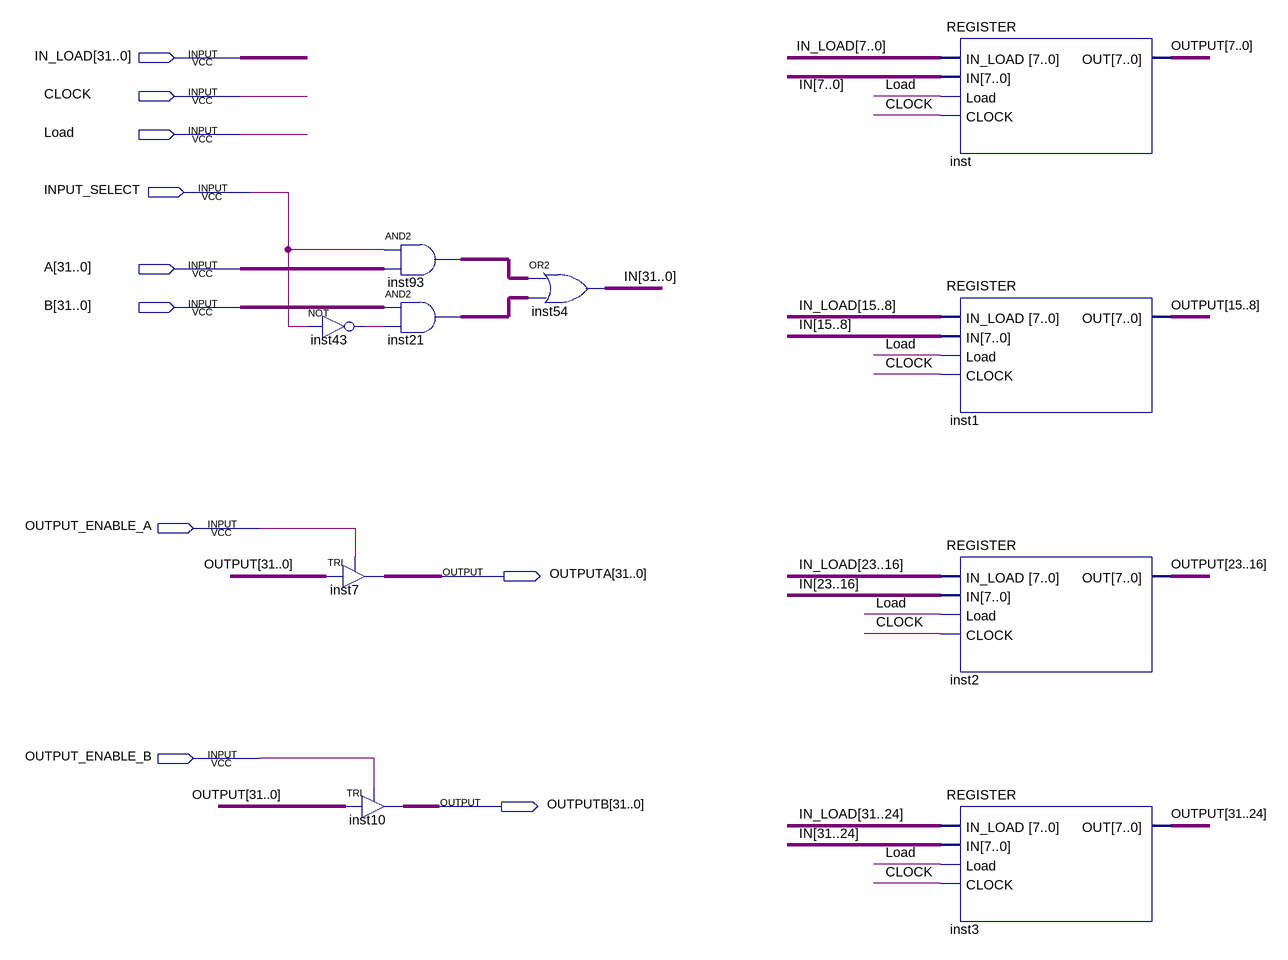
[diagram p0: schematic sheet]
// Quartus schematic REGISTER32.bdf as structural Verilog: 10 symbols, 10 pins
module REGISTER32 (
  input  [31:0] IN_LOAD,
  input  CLOCK,
  input  Load,
  input  INPUT_SELECT,
  input  [31:0] A,
  input  [31:0] B,
  input  OUTPUT_ENABLE_A,
  input  OUTPUT_ENABLE_B,
  output [31:0] OUTPUTA,
  output [31:0] OUTPUTB
);

  wire inst43_out;
  wire [31:0] IN, inst21_out, inst93_out, OUTPUT;

  not inst43 (inst43_out, INPUT_SELECT);
  TRI inst7[31:0] (.IN(OUTPUT), .OE(OUTPUT_ENABLE_A), .OUT(OUTPUTA));
  assign inst93_out = {32{INPUT_SELECT}} & A;  // AND2 inst93, 32 bits wide
  assign inst21_out = B & {32{inst43_out}};  // AND2 inst21, 32 bits wide
  TRI inst10[31:0] (.IN(OUTPUT), .OE(OUTPUT_ENABLE_B), .OUT(OUTPUTB));
  assign IN = inst93_out | inst21_out;  // OR2 inst54, 32 bits wide
  REGISTER inst (.IN_LOAD(IN_LOAD[7:0]), .IN(IN[7:0]), .Load(Load), .CLOCK(CLOCK), .OUT(OUTPUT[7:0]));
  REGISTER inst1 (.IN_LOAD(IN_LOAD[15:8]), .IN(IN[15:8]), .Load(Load), .CLOCK(CLOCK), .OUT(OUTPUT[15:8]));
  REGISTER inst2 (.IN_LOAD(IN_LOAD[23:16]), .IN(IN[23:16]), .Load(Load), .CLOCK(CLOCK), .OUT(OUTPUT[23:16]));
  REGISTER inst3 (.IN_LOAD(IN_LOAD[31:24]), .IN(IN[31:24]), .Load(Load), .CLOCK(CLOCK), .OUT(OUTPUT[31:24]));
endmodule
